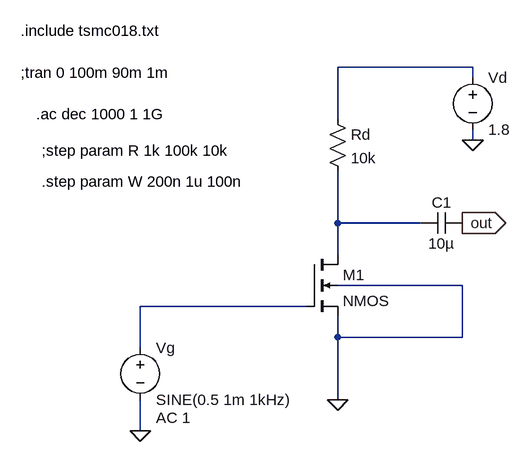
[diagram p0: schematic Mạch phân cực cho FET - Phân cực hồi tiếp điện áp.asc]
Mạch phân cực cho FET - Phân cực hồi tiếp điện áp.asc, the LTspice schematic file:
Version 4
SHEET 1 880 680
WIRE 288 -16 80 -16
WIRE 288 0 288 -16
WIRE 80 64 80 -16
WIRE 288 96 288 80
WIRE 80 224 80 144
WIRE 208 224 80 224
WIRE 80 272 80 224
WIRE 272 320 80 320
WIRE 32 352 -224 352
WIRE 80 400 80 368
WIRE 272 400 272 320
WIRE 272 400 80 400
WIRE -224 416 -224 352
WIRE 80 496 80 400
WIRE -224 544 -224 496
FLAG 288 96 0
FLAG 80 496 0
FLAG -224 544 0
FLAG 272 224 out
IOPIN 272 224 Out
SYMBOL voltage 288 -16 R0
WINDOW 123 0 0 Left 0
WINDOW 39 0 0 Left 0
SYMATTR InstName Vd
SYMATTR Value 1.8
SYMBOL voltage -224 400 R0
WINDOW 123 24 124 Left 2
WINDOW 39 0 0 Left 0
SYMATTR InstName Vg
SYMATTR Value SINE(0.5 1m 1kHz)
SYMATTR Value2 AC 1
SYMBOL res 64 48 R0
SYMATTR InstName Rd
SYMATTR Value 10k
SYMBOL cap 272 208 R90
WINDOW 0 0 32 VBottom 2
WINDOW 3 32 32 VTop 2
SYMATTR InstName C1
SYMATTR Value 10µ
SYMBOL nmos4 32 272 R0
SYMATTR InstName M1
SYMATTR Value2 l=180n w={W}
TEXT -408 -72 Left 2 !.include tsmc018.txt
TEXT -408 -8 Left 2 !;tran 0 100m 90m 1m
TEXT -384 56 Left 2 !.ac dec 1000 1 1G
TEXT -376 112 Left 2 !;step param R 1k 100k 10k
TEXT -376 160 Left 2 !.step param W 200n 1u 100n

The netlist it stands for:
* Mạch phân cực cho FET - Phân cực hồi tiếp điện áp.asc
Vd N001 0 1.8
Vg N003 0 SINE(0.5 1m 1kHz) AC 1
Rd N001 N002 10k
C1 out N002 10µ
M1 N002 N003 0 0 NMOS l=180n w={W}
.model NMOS NMOS
.model PMOS PMOS
.lib standard.mos
.include tsmc018.txt
;tran 0 100m 90m 1m
.ac dec 1000 1 1G
;step param R 1k 100k 10k
.step param W 200n 1u 100n
.backanno
.end